# Altium schematic sheet main.schdoc
size A2
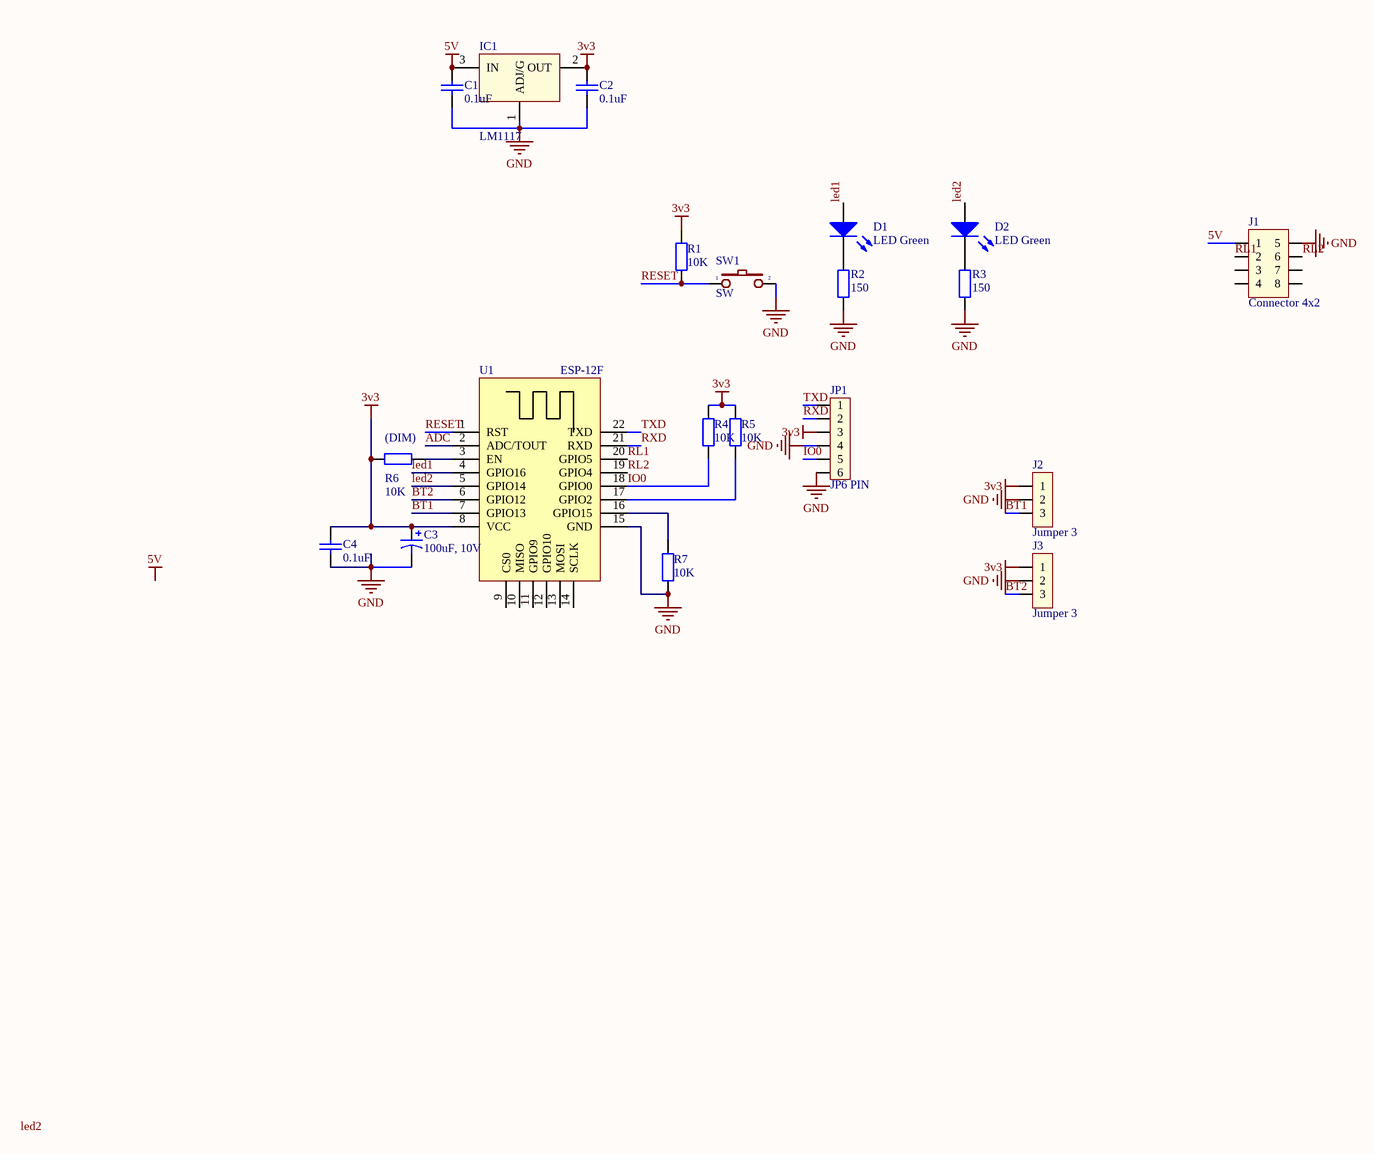
[diagram p0: main.schdoc]

## Parts
C1  value 0.1uF  [C0603]  (hidden comment: Ceramic Cap 0603 0.1uF 50V 10% X7R)
C2  value 0.1uF  [C0603]  (hidden comment: Ceramic Cap 0603 0.1uF 50V 10% X7R)
C3  value 100uF, 10V  [C2917]  (hidden comment: Tantalum Cap 2917 100uF 10V 10% 100 mOhm)
C4  value 0.1uF  [C0603]  (hidden comment: Ceramic Cap 0603 0.1uF 50V 10% X7R)
D1  LED Green  [LED0603-G]
D2  LED Green  [LED0603-G]
IC1  LM1117  [SOT223-4N]
J1  Connector 4x2  [JP4x2]
J2  Jumper 3  [JP3]
J3  Jumper 3  [JP3]
JP1  JP6 PIN  [JP6]
R1  value 10K  [R0603]  (hidden comment: RES 10K 5% 1/10W 0603)
R2  150  [R0603]
R3  150  [R0603]
R4  value 10K  [R0603]  (hidden comment: RES 10K 5% 1/10W 0603)
R5  value 10K  [R0603]  (hidden comment: RES 10K 5% 1/10W 0603)
R6  value 10K  [R0603]  (hidden comment: RES 10K 5% 1/10W 0603)
R7  value 10K  [R0603]  (hidden comment: RES 10K 5% 1/10W 0603)
SW1  SW  [SW1-SMD]
U1  ESP-12F  [ESP-12F]

## Nets
3v3: C2.1 C3.1 C4.1 IC1.2(OUT) J2.1 J3.1 JP1.3 R1.2 R4.2 R5.2 R6.2 U1.8(VCC)
5V: C1.1 IC1.3(IN) J1.1
GND: C1.2 C2.2 C3.2 C4.2 IC1.1(ADJ/G) J1.5 J2.2 J3.2 JP1.4 JP1.6 R2.2 R3.2 R7.2 SW1.2 U1.15(GND)
ADC: U1.2(ADC/TOUT)
BT1: J2.3 U1.7(GPIO13)
BT2: J3.3 U1.6(GPIO12)
IO0: JP1.5 R4.1 U1.18(GPIO0)
led1: D1.1(A) U1.4(GPIO16)
led2: D2.1(A) U1.5(GPIO14)
RESET: R1.1 SW1.1 U1.1(RST)
RL1: J1.2 U1.20(GPIO5)
RL2: J1.6 U1.19(GPIO4)
RXD: JP1.2 U1.21(RXD)
TXD: JP1.1 U1.22(TXD)
NetD1_2: D1.2(K) R2.1
NetD2_2: D2.2(K) R3.1
NetR5_1: R5.1 U1.17(GPIO2)
NetR6_1: R6.1 U1.3(EN)
NetR7_1: R7.1 U1.16(GPIO15)

Not connected (* = marked no-connect by the designer): J1 3 4 7 8; U1 9(CS0) 10(MISO) 11(GPIO9) 12(GPIO10) 13(MOSI) 14(SCLK)

## Notes on the sheet
- (near R6) (DIM)
- Labels drawn without touching a wire or pin: 5V, led2

## Library data of the parts
C1 C2 C4 = GRM188R71H104KA93: Murata General Purpose Ceramic Cap 0603 0.1uF 50V 10% X7R; Supplier 1: Digi-Key; Supplier Part Number 1: 490-1519-1-ND
C3 = TPSD107K010R0100: AVX Tantalum Cap 2917 100uF 10V 10% 100 mOhm; Supplier 1: Digi-Key; Supplier Part Number 1: 478-1777-1-ND
D1 D2 = LTST-C190KGKT: Lite-On LED Green 0603; Supplier Part Number 1: 160-1435-1-ND; Supplier 1: Digi-Key; Supplier Part Number 2: FL1526; Value: LED Green
IC1 = LM1117: 3v3; Value: LM317
J1 = JP4x2: Value: Connector 4x2
J2 J3 = JP3: Value: J3
JP1 = JP6: Value: JP7
R1 R4-R7 = RC0603JR-0710KL: Yageo RES 10K 5% 1/10W 0603; Supplier 1: Digi-Key; Supplier Part Number 1: 311-10KGRCT-ND
R2 R3 = RM: Resistor SMD; Value: 1K
SW1 = SW2: Switch button 2 pin; Value: SW chip 2 pin
U1 = ESP-12F: ESP-12F WiFi Module